# EAGLE design transmitter (EAGLE 9.6.2)
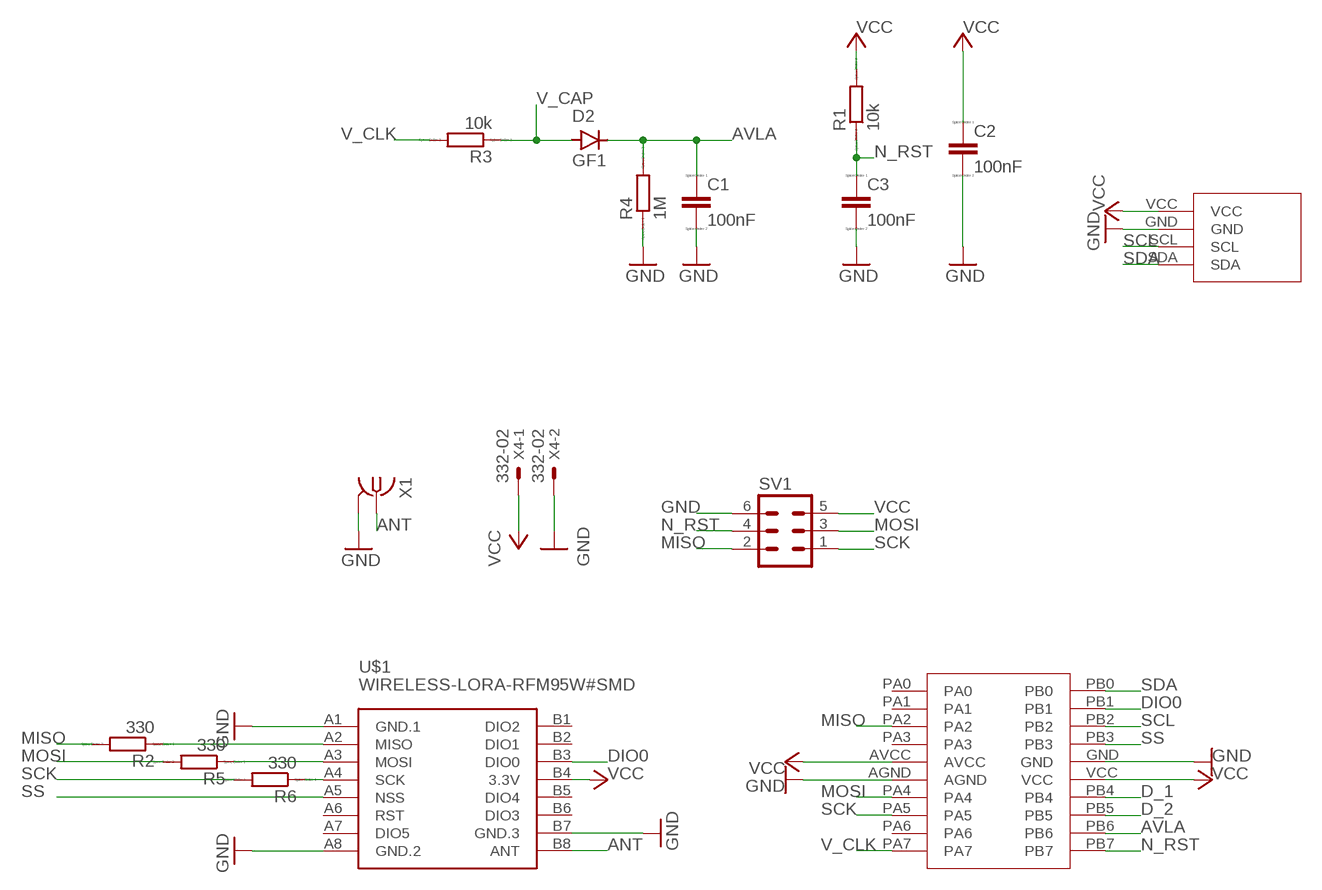
[diagram p0: schematic, sheet 1]

## Parts
ATTINY87_1  ATTINY87_SOIC  [20-SOIC]
C1  100nF  CC1206  [C1206]
C2  100nF  CC1206  [C1206]
C3  100nF  CC1206  [C1206]
D2  GF1  [SMA-DO214AC]
GY-68-1  GY-68-4  [GY-68-4]
R1  10k  R  [R0805]
R2  330  R  [R0805]
R3  10k  R  [R0805]
R4  1M  R  [R0805]
R5  330  R  [R0805]
R6  330  R  [R0805]
SV1  MA03-2  [MA03-2]
U$1  WIRELESS-LORA-RFM95W#SMD  [WIRELESS-LORA-RFM95W#SMD]
X1  BU-SMA-G  [BU-SMA-G]
X4  332-02  [332-02]

## Nets
ANT: U$1.B8(ANT) X1.1
AVLA: ATTINY87_1.PB6 C1.1 D2.K(C) R4.2
D_1: ATTINY87_1.PB4
D_2: ATTINY87_1.PB5
DIO0: ATTINY87_1.PB1 U$1.B3(DIO0)
GND [POWER]: ATTINY87_1.AGND ATTINY87_1.GND C1.2 C2.2 C3.2 GY-68-1.GND R4.1 SV1.6 U$1.A1(GND.1) U$1.A8(GND.2) U$1.B7(GND.3) X1.2 X1.3 X1.4 X1.5 X4.2
MISO: ATTINY87_1.PA2 R2.2 SV1.2
MOSI: ATTINY87_1.PA4 R5.2 SV1.3
N$1: R2.1 U$1.A2(MISO)
N$2: R5.1 U$1.A3(MOSI)
N$3: R6.1 U$1.A4(SCK)
N_RST: ATTINY87_1.PB7 C3.1 R1.1 SV1.4
SCK: ATTINY87_1.PA5 R6.2 SV1.1
SCL: ATTINY87_1.PB2 GY-68-1.SCL
SDA: ATTINY87_1.PB0 GY-68-1.SDA
SS: ATTINY87_1.PB3 U$1.A5(NSS)
V_CAP: D2.A R3.1
V_CLK: ATTINY87_1.PA7 R3.2
VCC [POWER]: ATTINY87_1.AVCC ATTINY87_1.VCC C2.1 GY-68-1.VCC R1.2 SV1.5 U$1.B4(3.3V) X4.1
Unconnected: ATTINY87_1.PA0 ATTINY87_1.PA1 ATTINY87_1.PA3 ATTINY87_1.PA6 U$1.A6(RST) U$1.A7(DIO5) U$1.B1(DIO2) U$1.B2(DIO1) U$1.B5(DIO4) U$1.B6(DIO3)

## Library data of the parts
ATTINY87_1 = STM32:ATTINY87_SOIC
C1-C3 = eagle-ltspice:C: CAPACITOR, European symbol; SPICEMODEL: NONE; SPICEPREFIX: C
D2 = diode:GF1: DIODE
GY-68-1 = GY-68:GY-68-4
R1-R6 = eagle-ltspice:R: RESISTOR, European symbol; SPICEMODEL: NONE; SPICEPREFIX: R
SV1 = con-lstb:MA03-2: PIN HEADER; OC_FARNELL: unknown; OC_NEWARK: unknown
U$1 = diy-modules:WIRELESS-LORA-RFM95W: 868/915 MHz LoRa Radio Transceiver Module based on SX1276 chip Click here to find device on ebay.com <http://www.ebay.com/sch/RFM95W+transceiver>
X1 = con-coax:BU-SMA-G: FEMALE SMA CONNECTOR Radiall distributor RS 193-9117; OC_FARNELL: unknown; OC_NEWARK: unknown
X4 = con-garry:332-02: 2 Pin - 2mm Dual Row Source: www.mpe-connector.de / garry_shortform_2012.pdf

## Net classes
0 default: width 0.254 mm
1 POWER: width 0.381 mm

## Board
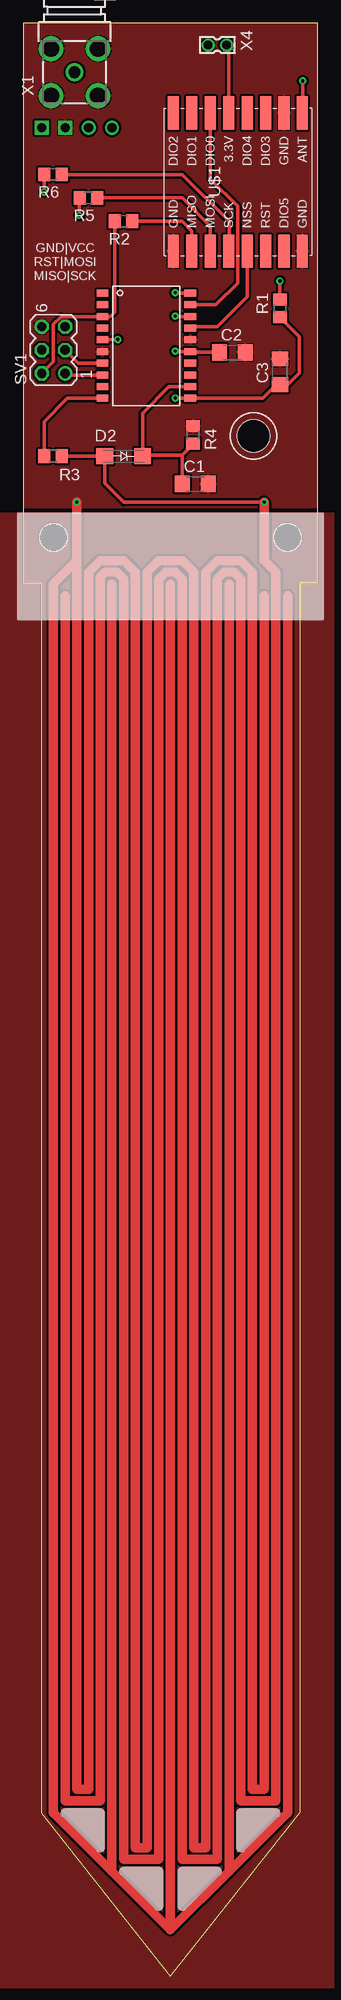
[diagram p1: board, top side]
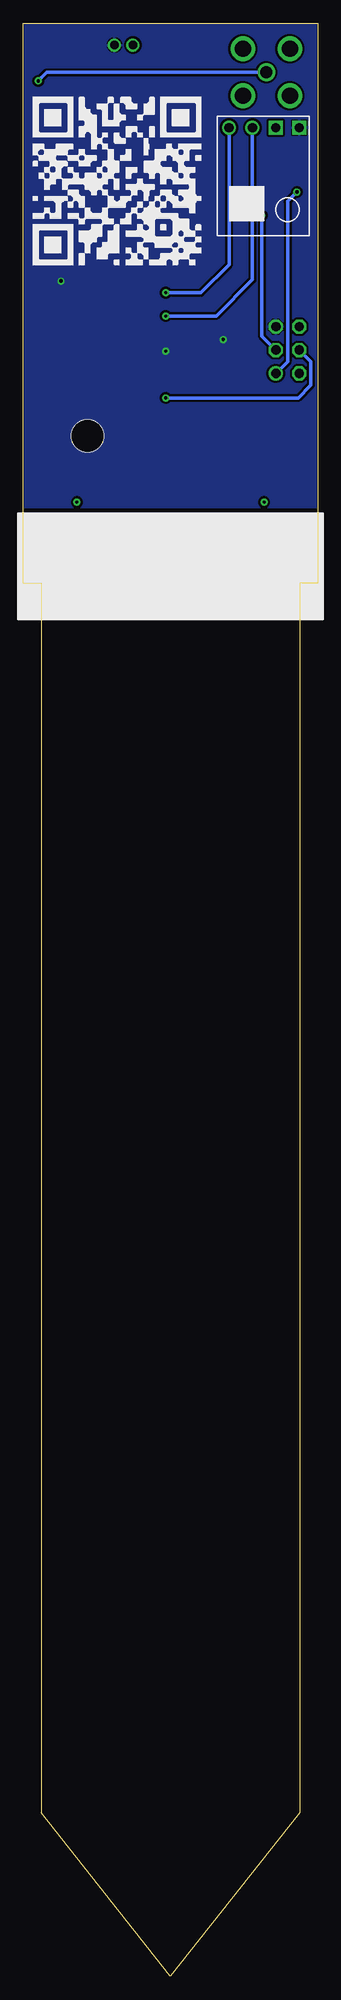
[diagram p2: board, bottom side, seen from below]

Size 32 x 212.02 mm. Coordinates in mm from the lower left corner, seen from the top.
Outline: 32,212.02 0,212.02 0,151.21 2,151.21 2,17.78 16,0 30,17.78 30,151.21 32,151.21 32,212.02
Copper layers (1*16): Top 0.035mm / dielectric 1.5mm / Bottom 0.035mm
Design rules "default *": minimum track width 6mil, minimum drill 0.35mm, track to track 10mil, track to pad 5mil, pad to pad 5mil, via to via 5mil, smd to smd 5mil, copper to edge 3mil, drill to drill 3mil, minimum pad ring 10mil, minimum via ring 8mil, stop-mask expansion 2mil, vias tented up to drill 0mil, thermal gap 5mil
Holes 3.5 mm at 25,167.21
Holes 3 mm at 3.3,156.21 28.7,156.21

### Footprints (pad centres in the part's own frame; a part is rotated, then mirrored left to right if it is on the bottom)
20-SOIC = smd 0.76 x 1.27: AGND 6.35,0; AVCC 5.08,0; GND 5.08,9.53; PA0 0,0; PA1 1.27,0; PA2 2.54,0; PA3 3.81,0; PA4 7.62,0; PA5 8.89,0; PA6 10.16,0; PA7 11.43,0; PB0 0,9.53; PB1 1.27,9.53; PB2 2.54,9.53; PB3 3.81,9.53; PB4 7.62,9.53; PB5 8.89,9.53; PB6 10.16,9.53; PB7 11.43,9.53; VCC 6.35,9.53
C1206 = smd 1.6 x 1.8: 1 -1.4,0; 2 1.4,0
SMA-DO214AC = smd 1.8 x 1.7: A -2.05,0; K 2.05,0
GY-68-4 = drill 1 square: GND 1.27,6.35; VCC 1.27,8.89 | drill 1: SCL 1.27,3.81; SDA 1.27,1.27
R0805 = smd 1.3 x 1.5: 1 -0.95,0; 2 0.95,0
MA03-2 = drill 1.016: 1 -2.54,-1.27 | drill 1.016 octagon: 2 -2.54,1.27; 3 0,-1.27; 4 0,1.27; 5 2.54,-1.27; 6 2.54,1.27
WIRELESS-LORA-RFM95W#SMD = smd 3.6 x 1.2: A1 -7.5,7; A2 -7.5,5; A3 -7.5,3; A4 -7.5,1; A5 -7.5,-1; A6 -7.5,-3; A7 -7.5,-5; A8 -7.5,-7; B1 7.5,7; B2 7.5,5; B3 7.5,3; B4 7.5,1; B5 7.5,-1; B6 7.5,-3; B7 7.5,-5; B8 7.5,-7
BU-SMA-G = drill 1.27: 1 0,0 | drill 1.778: 2 -2.55,2.55; 3 2.55,2.55; 4 2.55,-2.55; 5 -2.55,-2.55
332-02 = drill 0.9 pad 1.27: 1 0,-1; 2 0,1

### Placement (x,y rotation side)
ATTINY87_1  8.61,182.71 270 top
C1  18.69,161.99 0 top
C2  22.71,176.28 0 top
C3  27.88,174.17 90 top
D2  10.92,165.01 0 top
GY-68-1  10.92,201.93 270 bottom
R1  27.88,181.04 90 top
R2  10.92,190.5 180 top
R3  3.24,165.01 180 top
R4  18.45,167.32 270 top
R5  7.11,193.04 180 top
R6  3.26,195.58 180 top
SV1  3.3,176.53 90 top
U$1  23.32,194.76 90 top
X1  5.6,206.68 90 top
X4  21.08,209.63 90 top

### Tracks (layer width: path | path; a pad name or v marks a point on that pad's centre or on a via)
ANT  (via drill 0.35)
  Top 0.381: v30.35,205.74 30.35,202.29 U$1.B8
  Bottom 0.381: 6.17,206.68 X1.1 29.41,206.68 v30.35,205.74
AVLA
  Top 0.381: ATTINY87_1.PB6 15.83,172.55 12.97,169.69 D2.K 13.06,165.1 17.27,165.1 | R4.2 18.49,166.32 | 18.49,166.32 18.56,166.26 | 17.27,165.1 18.49,166.32 | C1.1 17.27,162.01 17.27,165.1
DIO0
  Top 0.381: U$1.B3 20.32,195.07 23.28,192.11 23.28,183.81 20.91,181.44 ATTINY87_1.PB1
GND  (via drill 0.35)
  Top 1.016: v5.84,160.02 5.84,153.67 | 5.84,153.67 3.3,151.13 3.3,17.78 9.65,11.43 | 16,5.08 9.65,11.43 | 28.7,149.86 28.7,17.78 22.35,11.43 | 16,5.08 22.35,11.43 | 16,5.08 16,151.13 | 22.35,151.13 22.35,11.43 | 9.65,11.43 9.65,151.13 | 5.84,153.67 5.84,20.32 7.11,20.32 7.11,152.4 8.38,153.67 10.92,153.67 12.19,152.4 12.19,13.97 13.46,13.97 13.46,152.4 14.73,153.67 17.27,153.67 18.54,152.4 18.54,13.97 19.81,13.97 19.81,152.4 21.08,153.67 23.62,153.67 24.89,152.4 24.89,20.32 26.16,20.32 26.16,149.86
  pour Top: -5.59,222.25 37.59,222.25 37.59,159.49 -5.59,159.49
MISO
  Top 0.381: SV1.2 3.3,175.26 3.3,179.33 4.14,180.17 ATTINY87_1.PA2 9.48,180.17 9.97,180.66 R2.2 9.9,190.43
MOSI  (via drill 0.35)
  Top 0.381: ATTINY87_1.PA4 6.01,175.09 SV1.3 | v6.09,191.13 6.09,192.97 R5.2
  Bottom 0.381: v6.09,191.13 6.09,178.05 SV1.3
N$1
  Top 0.381: U$1.A2 18.32,189.45 17.27,190.5 R2.1
N$2
  Top 0.381: U$1.A3 20.32,189.99 17.27,193.04 R5.1
N$3
  Top 0.381: U$1.A4 22.35,187.29 22.35,190.5 17.27,195.58 R6.1
N_RST  (via drill 0.35)
  Top 0.381: ATTINY87_1.PB7 18.31,171.45 | ATTINY87_1.PB7 18.1,171.32 v16.51,171.32 | R1.1 29.97,178 29.97,174.04 28.7,172.77 C3.1 27.43,172.72 25.99,171.28 ATTINY87_1.PB7
  Bottom 0.381: SV1.4 0.76,175.26 0.76,172.72 2.16,171.32 v16.51,171.32
NONAME
  pour Top: -3.05,158.89 33.78,158.89 33.78,-1.27 -3.05,-1.27
SCK  (via drill 0.35)
  Top 0.381: ATTINY87_1.PA5 4.74,173.82 SV1.1 | v2.28,193.68 2.28,195.55 R6.2
  Bottom 0.381: v2.28,193.68 3.3,192.66 3.3,175.26 SV1.1
SCL  (via drill 0.35)
  Top 0.381: ATTINY87_1.PB2 16.68,180.17 v16.51,180.21
  Bottom 0.381: GY-68-1.SCL 7.11,184.15 11.05,180.21 v16.51,180.21
SDA  (via drill 0.35)
  Top 0.381: ATTINY87_1.PB0 16.68,182.71 v16.51,182.75
  Bottom 0.381: v16.51,182.75 12.7,182.75 9.65,185.8 GY-68-1.SDA
SS
  Top 0.381: ATTINY87_1.PB3 18.31,179.07 21.08,179.07 24.32,182.31 U$1.A5
V_CAP  (via drill 0.35)
  Top 0.381: v26.16,160.02 10.92,160.02 8.87,162.07 D2.A R3.1
  Top 1.016: v26.16,160.02 26.16,153.67 27.43,152.4 27.43,19.05 23.62,19.05 23.62,151.66 22.88,152.4 21.82,152.4 21.08,151.66 21.08,12.7 17.27,12.7 17.27,151.66 16.53,152.4 15.47,152.4 14.73,151.66 14.73,12.7 10.92,12.7 10.92,151.66 10.18,152.4 8.91,152.4 8.38,151.87 8.38,19.05 4.57,19.05 4.57,149.86
V_CLK
  Top 0.381: 8.61,171.22 ATTINY87_1.PA7 4.8,171.28 2.29,168.77 R3.2
VCC  (via drill 0.35)
  Top 0.381: C2.1 18.2,176.3 ATTINY87_1.VCC 16.55,176.36 v16.51,176.4 | v10.29,177.67 8.65,177.67 ATTINY87_1.AVCC | X4.1 22.32,209.39 U$1.B4 | v27.88,184.02 R1.2
  pour Bottom: -4.32,220.98 36.32,220.98 36.32,159.47 -4.32,159.47

### Text on the board
tPlace: GND|VCC / RST|MOSI / MISO|SCK